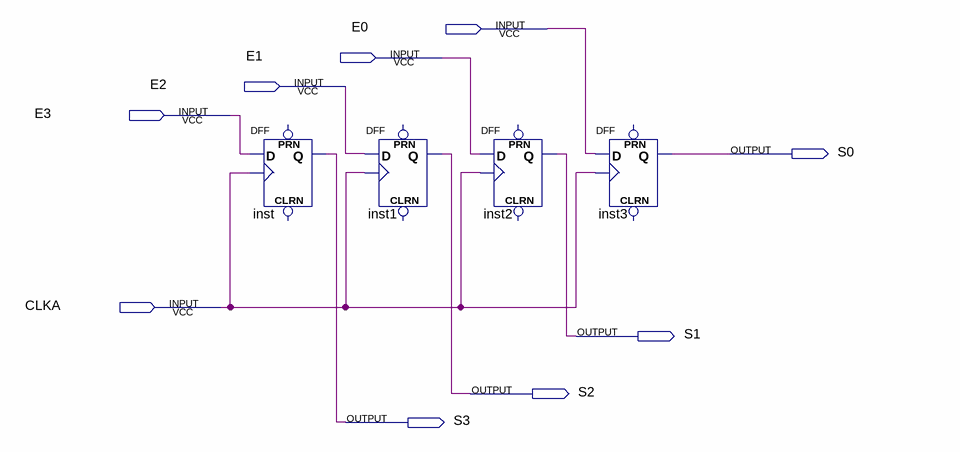
[diagram p0: schematic sheet]
// Quartus schematic RegNum.bdf as structural Verilog: 4 symbols, 9 pins
module RegNum (
  input  E0,
  input  E1,
  input  E2,
  input  E3,
  input  CLKA,
  output S0,
  output S1,
  output S2,
  output S3
);

  DFF inst (.CLK(CLKA), .D(E3), .Q(S3));  // open: CLRN, PRN
  DFF inst1 (.CLK(CLKA), .D(E2), .Q(S2));  // open: CLRN, PRN
  DFF inst2 (.CLK(CLKA), .D(E1), .Q(S1));  // open: CLRN, PRN
  DFF inst3 (.CLK(CLKA), .D(E0), .Q(S0));  // open: CLRN, PRN
endmodule
